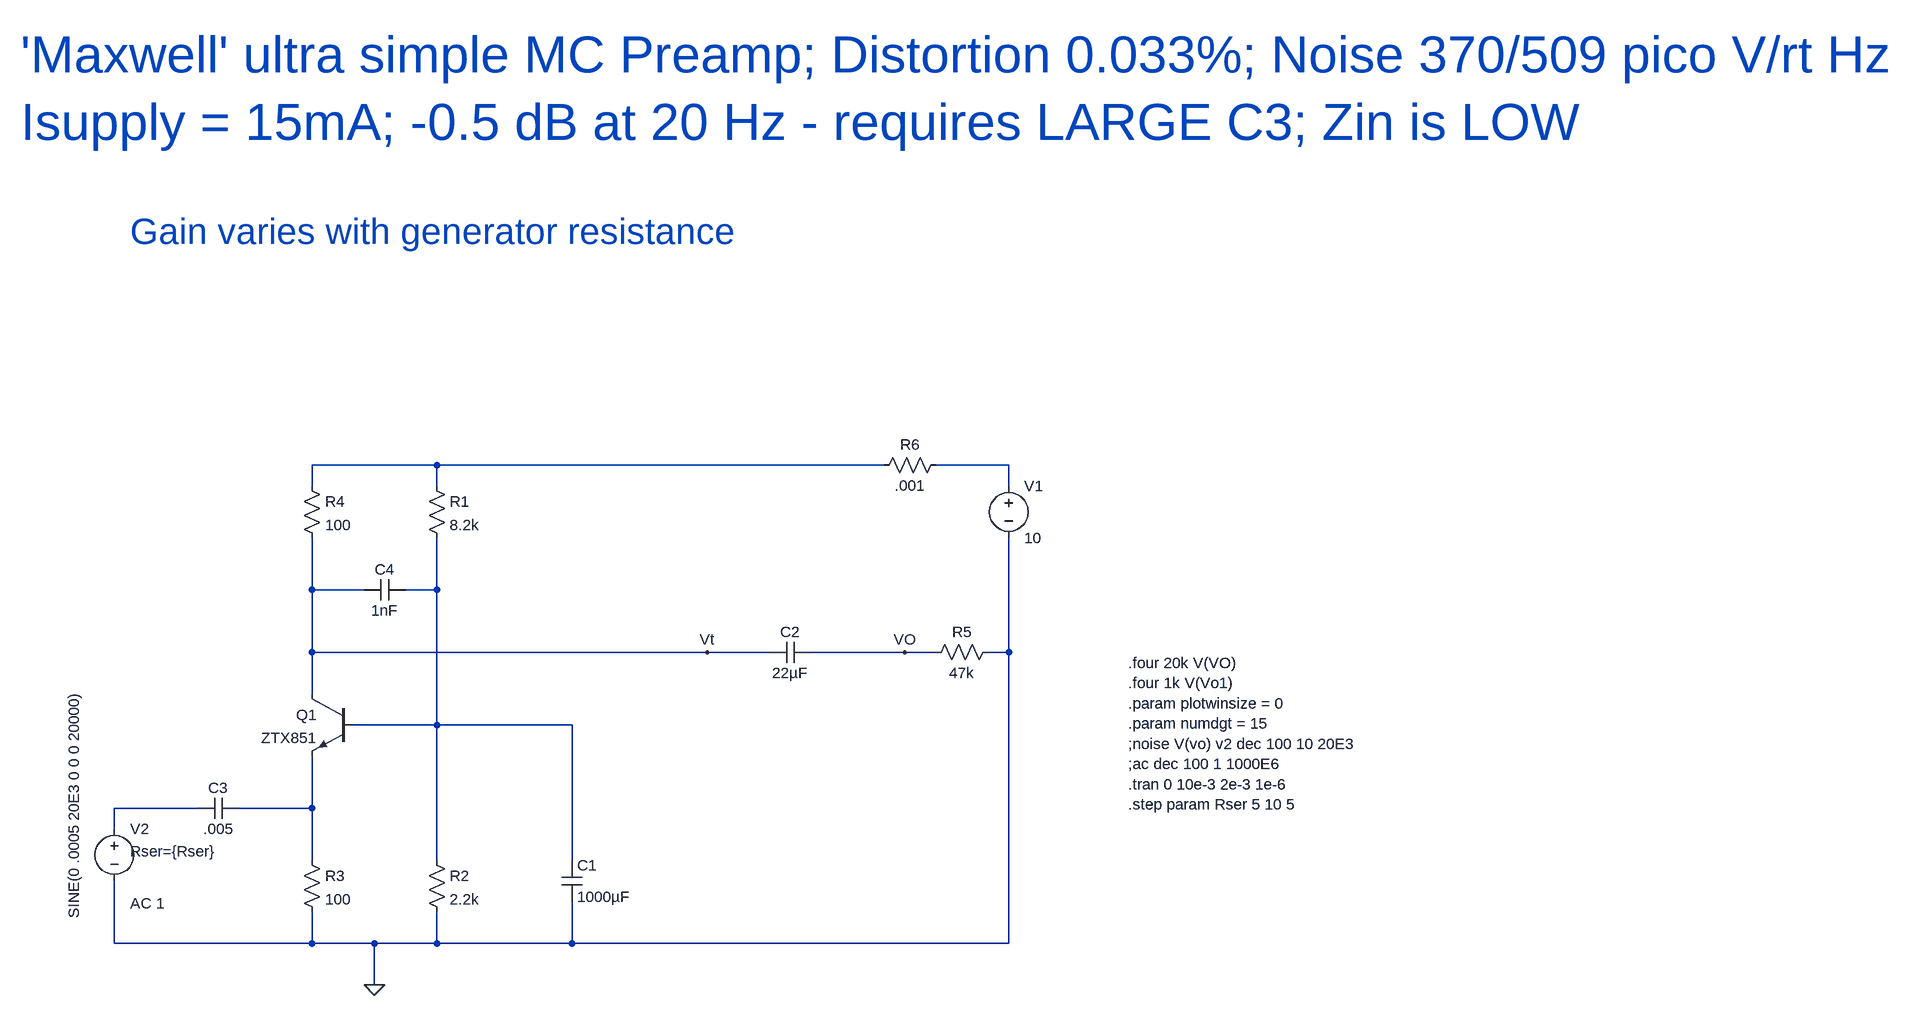
[diagram p0: schematic Maxwell.asc]
Maxwell.asc, the LTspice schematic file:
Version 4
SHEET 1 3160 824
WIRE -96 0 -288 0
WIRE 592 0 -96 0
WIRE 784 0 672 0
WIRE -288 32 -288 0
WIRE -96 32 -96 0
WIRE 784 32 784 0
WIRE -288 192 -288 112
WIRE -208 192 -288 192
WIRE -96 192 -96 112
WIRE -96 192 -144 192
WIRE -288 288 -288 192
WIRE 320 288 -288 288
WIRE 416 288 320 288
WIRE 624 288 480 288
WIRE 672 288 624 288
WIRE 784 288 784 112
WIRE 784 288 752 288
WIRE -288 352 -288 288
WIRE -96 400 -96 192
WIRE -96 400 -224 400
WIRE 112 400 -96 400
WIRE -464 528 -592 528
WIRE -288 528 -288 448
WIRE -288 528 -400 528
WIRE -592 560 -592 528
WIRE -288 608 -288 528
WIRE -96 608 -96 400
WIRE 112 608 112 400
WIRE -592 736 -592 640
WIRE -288 736 -288 688
WIRE -288 736 -592 736
WIRE -192 736 -288 736
WIRE -96 736 -96 688
WIRE -96 736 -192 736
WIRE 112 736 112 672
WIRE 112 736 -96 736
WIRE 784 736 784 288
WIRE 784 736 112 736
WIRE -192 800 -192 736
FLAG -192 800 0
FLAG 624 288 VO
FLAG 320 288 Vt
SYMBOL voltage 784 16 R0
WINDOW 123 0 0 Left 2
WINDOW 39 0 0 Left 2
SYMATTR InstName V1
SYMATTR Value 10
SYMBOL voltage -592 544 R0
WINDOW 3 -62 -197 VRight 2
WINDOW 123 24 130 Left 2
WINDOW 39 24 50 Left 2
SYMATTR Value SINE(0 .0005 20E3 0 0 0 20000)
SYMATTR Value2 AC 1
SYMATTR SpiceLine Rser={Rser}
SYMATTR InstName V2
SYMBOL npn -224 352 M0
SYMATTR InstName Q1
SYMATTR Value ZTX851
SYMBOL res -112 16 R0
SYMATTR InstName R1
SYMATTR Value 8.2k
SYMBOL res -304 592 R0
SYMATTR InstName R3
SYMATTR Value 100
SYMBOL cap 96 608 R0
SYMATTR InstName C1
SYMATTR Value 1000µF
SYMBOL res -304 16 R0
SYMATTR InstName R4
SYMATTR Value 100
SYMBOL cap 480 272 R90
WINDOW 0 0 32 VBottom 2
WINDOW 3 32 32 VTop 2
SYMATTR InstName C2
SYMATTR Value 22µF
SYMBOL res 768 272 R90
WINDOW 0 0 56 VBottom 2
WINDOW 3 32 56 VTop 2
SYMATTR InstName R5
SYMATTR Value 47k
SYMBOL cap -400 512 R90
WINDOW 0 0 32 VBottom 2
WINDOW 3 32 32 VTop 2
SYMATTR InstName C3
SYMATTR Value .005
SYMBOL res -112 592 R0
SYMATTR InstName R2
SYMATTR Value 2.2k
SYMBOL cap -144 176 R90
WINDOW 0 0 32 VBottom 2
WINDOW 3 32 32 VTop 2
SYMATTR InstName C4
SYMATTR Value 1nF
SYMBOL res 688 -16 R90
WINDOW 0 0 56 VBottom 2
WINDOW 3 32 56 VTop 2
SYMATTR InstName R6
SYMATTR Value .001
TEXT 968 304 Left 2 !.four 20k V(VO)\n.four 1k V(Vo1)\n.param plotwinsize = 0\n.param numdgt = 15\n;noise V(vo) v2 dec 100 10 20E3\n;ac dec 100 1 1000E6\n.tran 0 10e-3 2e-3 1e-6\n.step param Rser 5 10 5
TEXT -736 -632 Left 6 ;'Maxwell' ultra simple MC Preamp; Distortion 0.033%; Noise 370/509 pico V/rt Hz\nIsupply = 15mA; -0.5 dB at 20 Hz - requires LARGE C3; Zin is LOW
TEXT -568 -360 Left 5 ;Gain varies with generator resistance

The netlist it stands for:
* Maxwell.asc
V1 N002 0 10
V2 N004 0 SINE(0 .0005 20E3 0 0 0 20000) AC 1 Rser={Rser}
Q1 Vt N003 N005 0 ZTX851
R1 N001 N003 8.2k
R3 N005 0 100
C1 N003 0 1000µF
R4 N001 Vt 100
C2 VO Vt 22µF
R5 0 VO 47k
C3 N005 N004 .005
R2 N003 0 2.2k
C4 N003 Vt 1nF
R6 N002 N001 .001
.model NPN NPN
.model PNP PNP
.lib standard.bjt
.four 20k V(VO)
.four 1k V(Vo1)
.param plotwinsize = 0
.param numdgt = 15
;noise V(vo) v2 dec 100 10 20E3
;ac dec 100 1 1000E6
.tran 0 10e-3 2e-3 1e-6
.step param Rser 5 10 5
* 'Maxwell' ultra simple MC Preamp; Distortion 0.033%; Noise 370/509 pico V/rt Hz
* Isupply = 15mA; -0.5 dB at 20 Hz - requires LARGE C3; Zin is LOW
* Gain varies with generator resistance
.backanno
.end